# EAGLE design ai_breakout_spi (EAGLE 6.5.0)
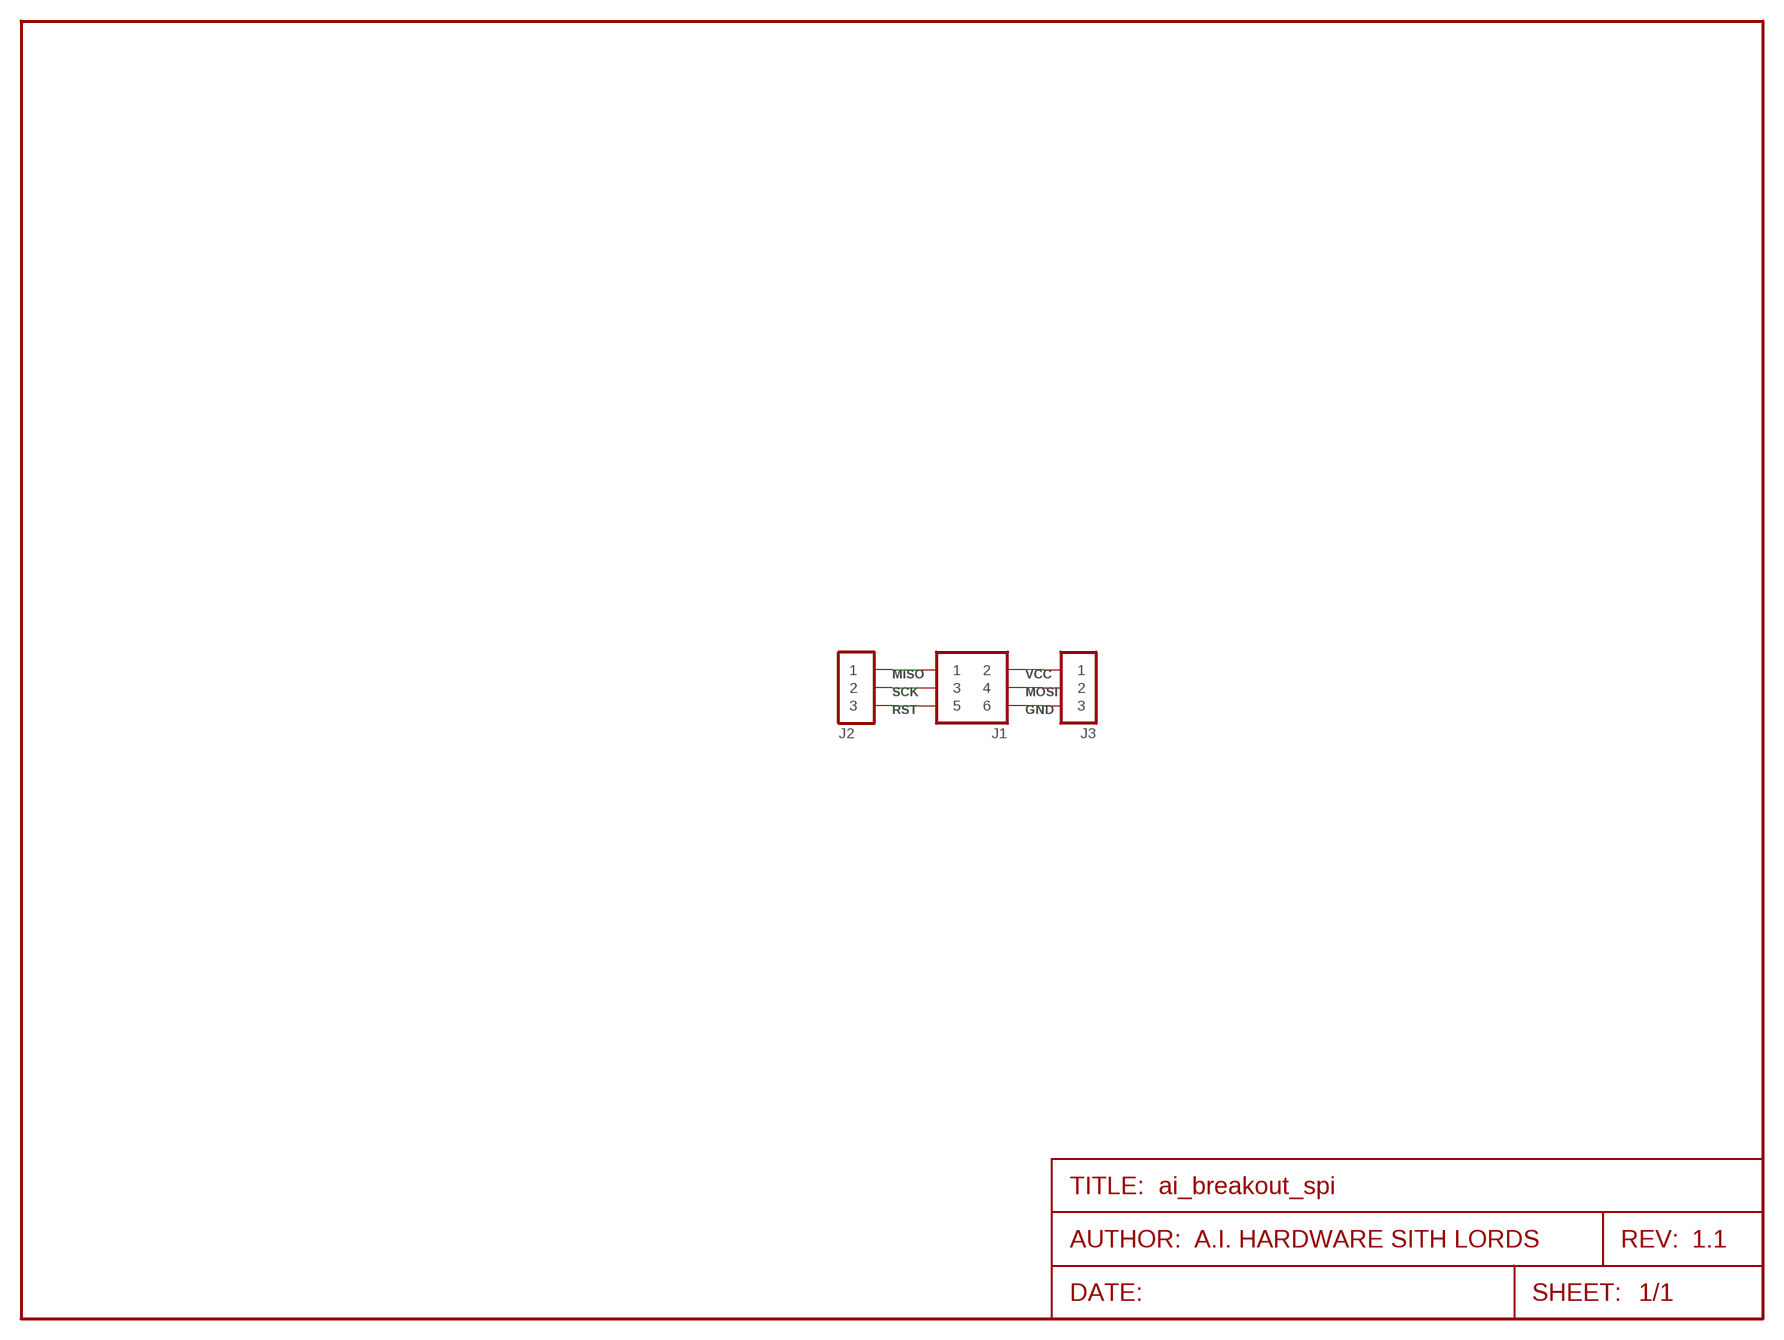
[diagram p0: schematic, sheet 1]
FRAME1 (FRAME-LETTER): AUTHOR: A.I. HARDWARE SITH LORDS; REV: 1.1

## Parts
J1  2X03  [2X03]
J2  1X03  [1X03]
J3  1X03NOFIRST  [1X03-NOFIRST]

## Nets
GND: J1.6 J3.3
MISO: J1.1 J2.1
MOSI: J1.4 J3.2
RST: J1.5 J2.3
SCK: J1.3 J2.2
VCC: J1.2 J3.1

## Library data of the parts
J1 = Ai_Connectors:2X03
J2 J3 = Ai_Connectors:1X03

## Board
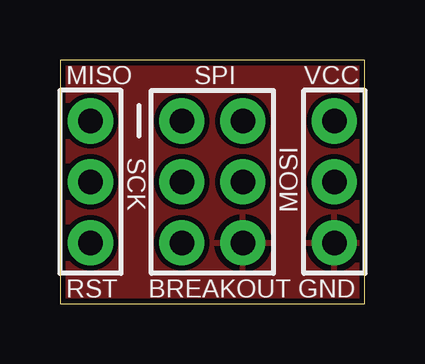
[diagram p1: board, top side]
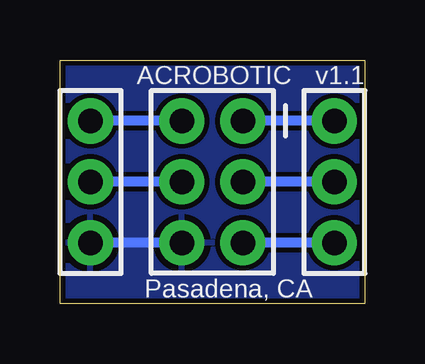
[diagram p2: board, bottom side, seen from below]

Size 12.7 x 10.16 mm. Coordinates in mm from the lower left corner, seen from the top.
Outline: 0,10.16 0,0 12.7,0 12.7,10.16 0,10.16
Copper layers (1*16): Top 0.035mm / dielectric 1.5mm / Bottom 0.035mm
Design rules "ai_2layer": minimum track width 7mil, minimum drill 15mil, track to track 8mil, track to pad 8mil, pad to pad 8mil, via to via 8mil, smd to smd 8mil, copper to edge 8mil, drill to drill 8mil, minimum pad ring 12mil, minimum via ring 10mil, stop-mask expansion 4mil, vias tented up to drill 20mil, thermal gap 10mil

### Footprints (pad centres in the part's own frame; a part is rotated, then mirrored left to right if it is on the bottom)
2X03 = drill 1.016 pad 1.88: 1 -2.54,-1.27; 2 -2.54,1.27; 3 0,-1.27; 4 0,1.27; 5 2.54,-1.27; 6 2.54,1.27
1X03 = drill 1.016 pad 1.88: 1 -2.54,0; 2 0,0; 3 2.54,0
1X03-NOFIRST = drill 1.016 pad 1.88: 1 -2.54,0; 2 0,0; 3 2.54,0

### Placement (x,y rotation side)
J1  6.35,5.08 270 top
J2  1.27,5.08 270 top
J3  11.43,5.08 270 top

### Tracks (layer width: path | path; a pad name or v marks a point on that pad's centre or on a via)
GND
  Bottom 0.406: J1.6 J3.3
  pour Bottom: 0,10.16 0,0 12.7,0 12.7,10.16
  pour Top: 0,10.16 0,0 12.7,0 12.7,10.16
MISO
  Bottom 0.406: J2.1 J1.1
MOSI
  Bottom 0.406: J1.4 J3.2
RST
  Bottom 0.406: J2.3 J1.5
SCK
  Bottom 0.406: J2.2 J1.3
VCC
  Bottom 0.406: J1.2 J3.1

### Text on the board
tNames: MISO | SPI | VCC | SCK | MOSI | RST | BREAKOUT | GND
bNames: v1.1 | ACROBOTIC | Pasadena, CA